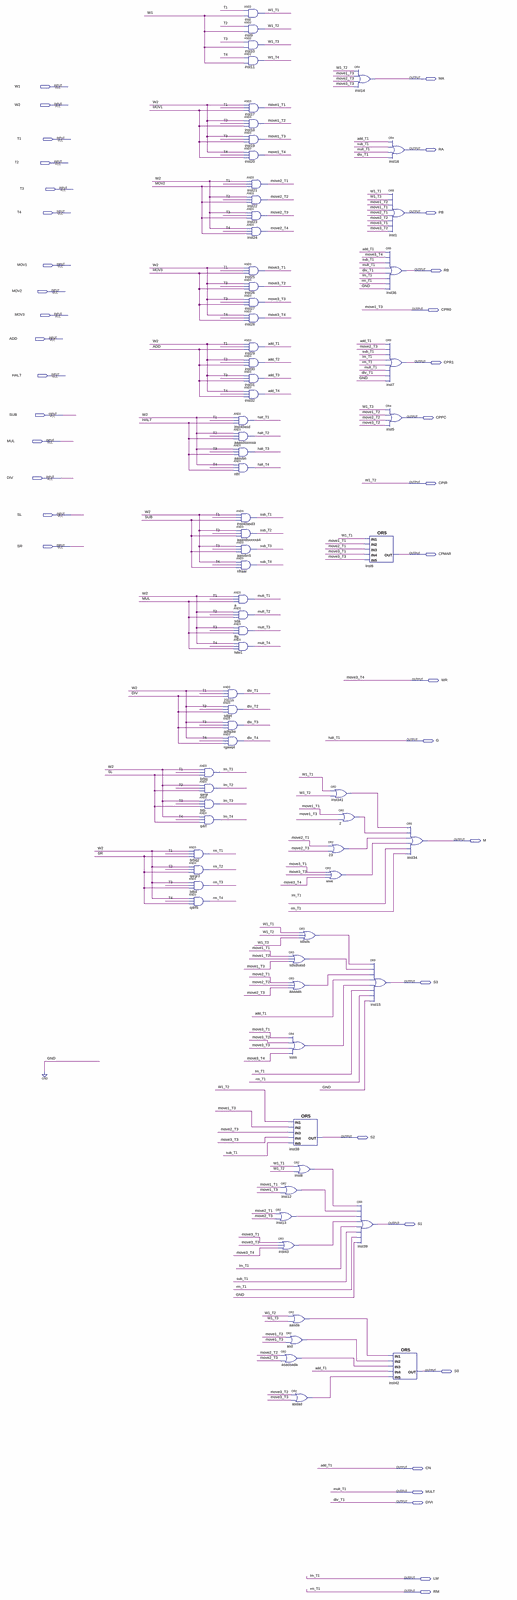
[diagram p0: schematic sheet, whole]
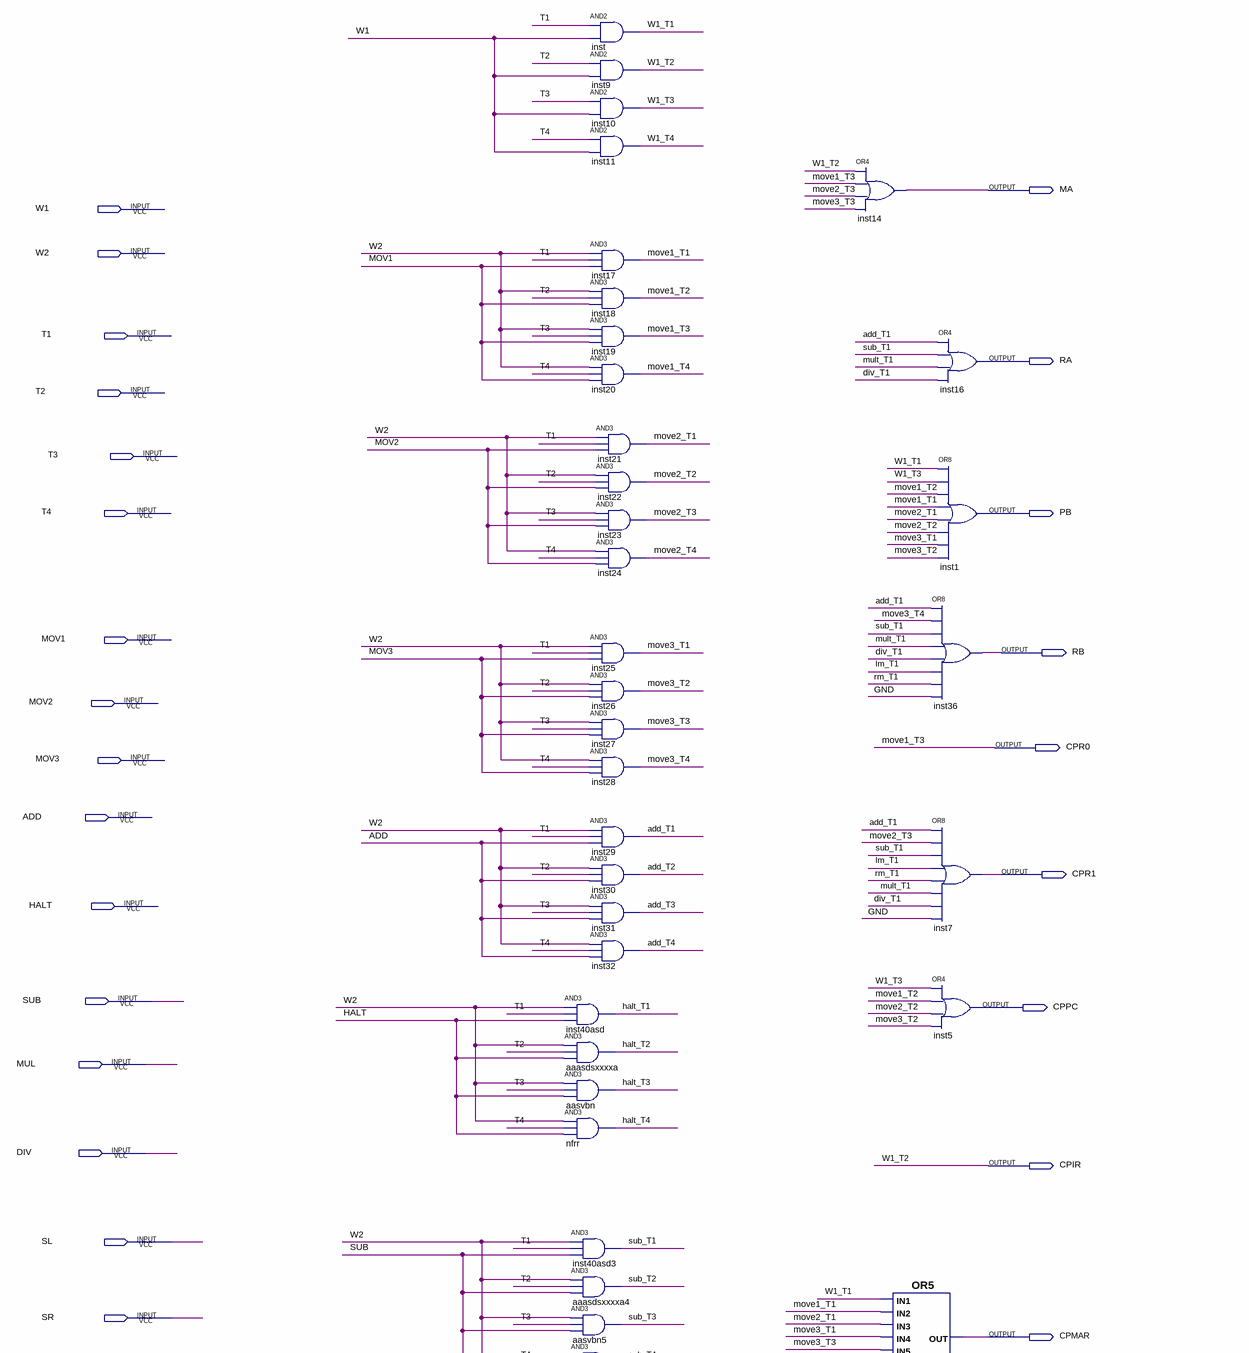
[diagram p1: schematic sheet, upper part]
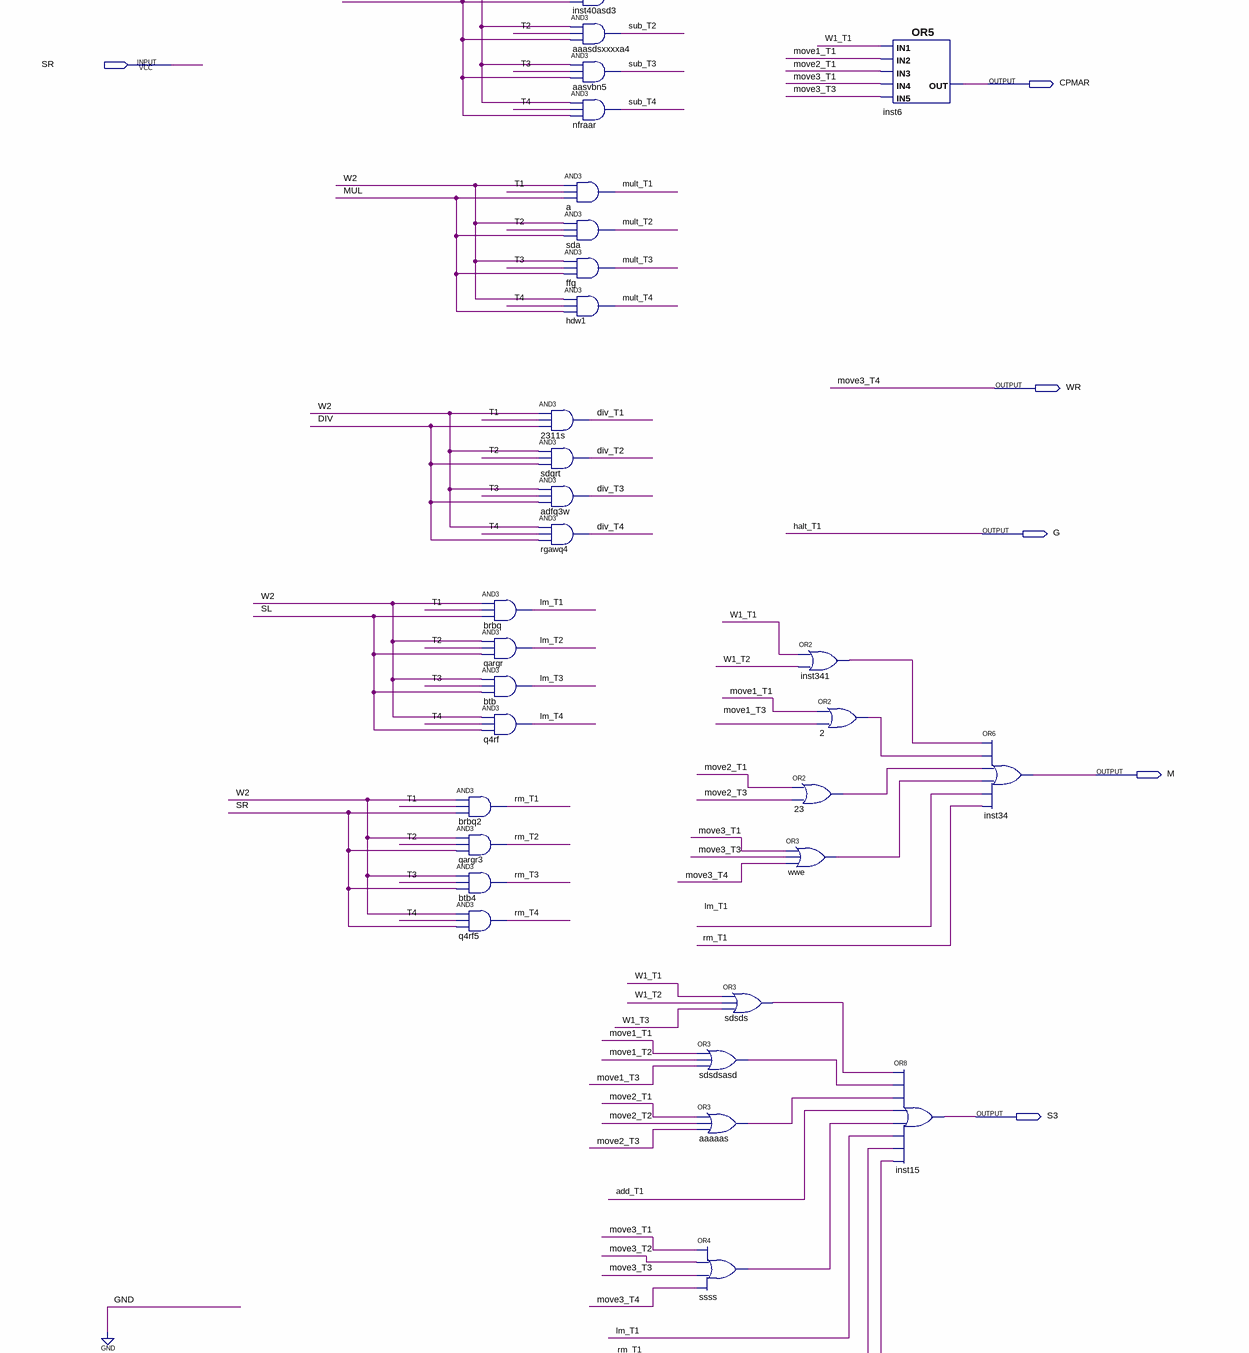
[diagram p2: schematic sheet, middle part]
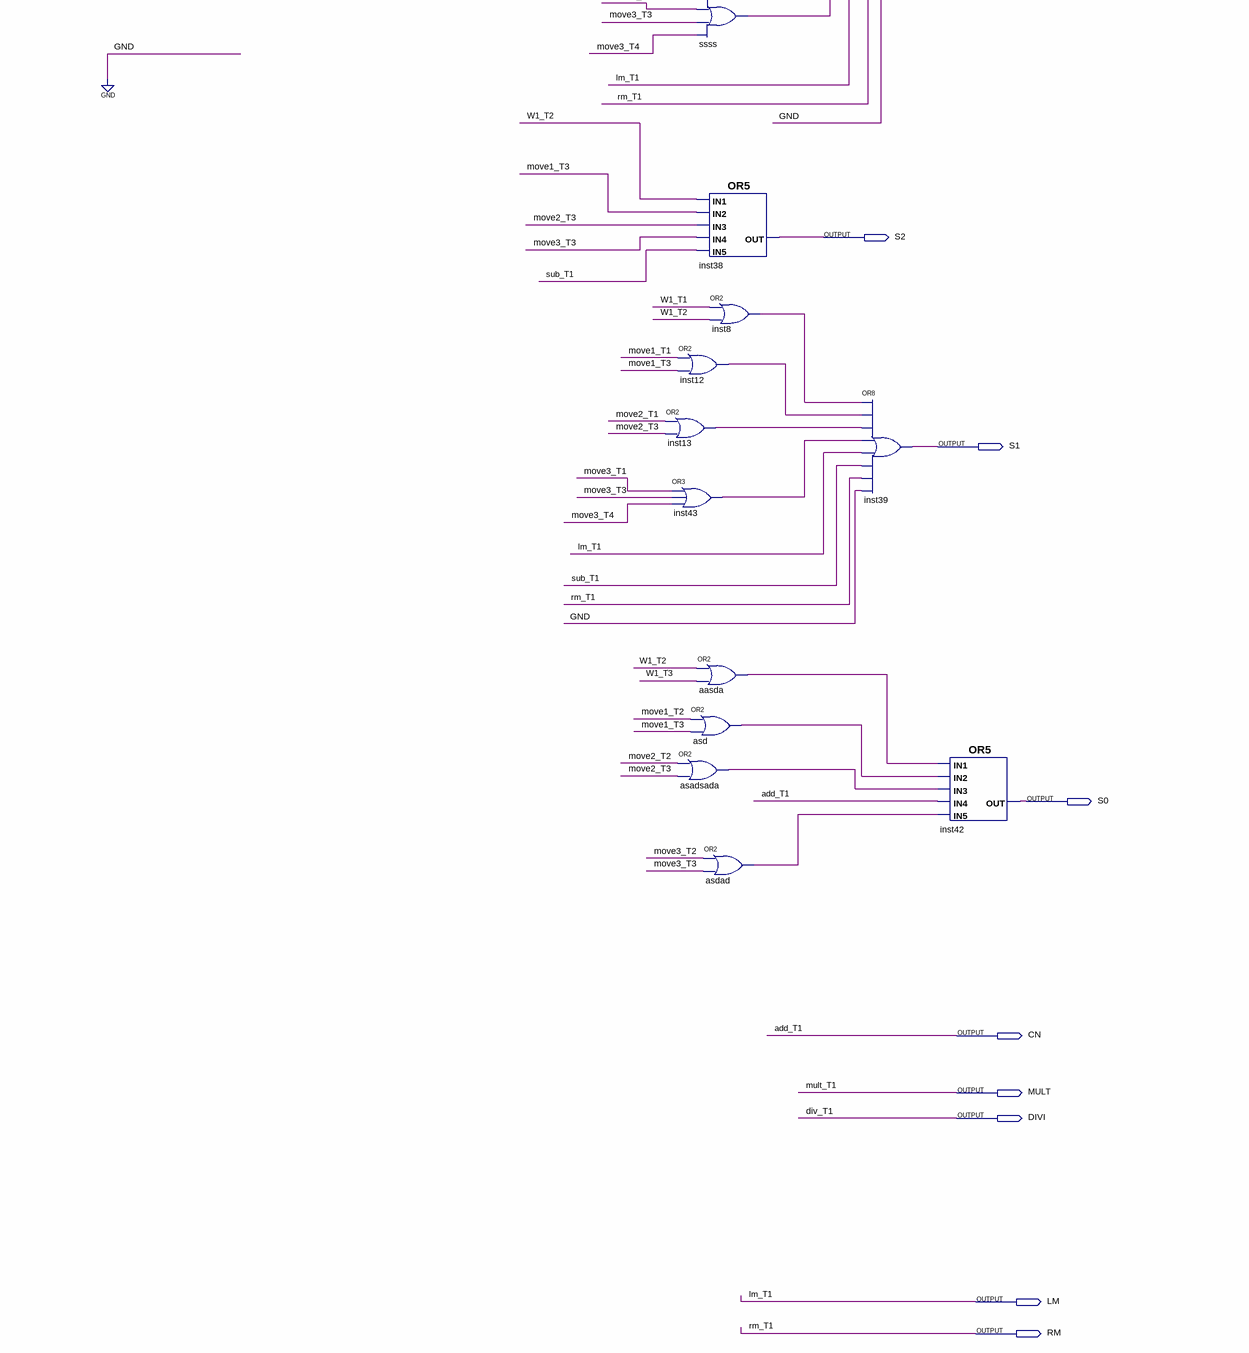
[diagram p3: schematic sheet, lower part]
// Quartus schematic OP_CONTROL.bdf as structural Verilog: 72 symbols, 37 pins
module OP_CONTROL (
  input  W1,
  input  W2,
  input  T1,
  input  T2,
  input  T3,
  input  T4,
  input  MOV1,
  input  MOV2,
  input  MOV3,
  input  ADD,
  input  HALT,
  input  SUB,
  input  MUL,
  input  DIV,
  input  SL,
  input  SR,
  output MA,
  output RA,
  output PB,
  output RB,
  output CPR0,
  output CPR1,
  output CPPC,
  output CPIR,
  output CPMAR,
  output WR,
  output G,
  output M,
  output S3,
  output S2,
  output S1,
  output S0,
  output CN,
  output MULT,
  output DIVI,
  output LM,
  output RM
);

  wire aaaaas_out, aasda_out, add_T2, add_T3, add_T4, asadsada_out, asd_out, asdad_out, div_T2, div_T3,
       div_T4, halt_T2, halt_T3, halt_T4, inst8_out, inst12_out, inst13_out, inst43_out, inst341_out, lm_T2,
       lm_T3, lm_T4, move1_T1, move1_T2, move1_T4, move2_T1, move2_T2, move2_T3, move2_T4, move3_T1,
       move3_T2, move3_T3, mult_T2, mult_T3, mult_T4, n2_out, n23_out, rm_T2, rm_T3, rm_T4, sdsds_out,
       sdsdsasd_out, ssss_out, sub_T1, sub_T2, sub_T3, sub_T4, W1_T1, W1_T3, W1_T4, wwe_out;

  and brbq2 (RM, W2, T1, SR);
  and qargr3 (rm_T2, W2, T2, SR);
  and btb4 (rm_T3, W2, T3, SR);
  and q4rf5 (rm_T4, W2, T4, SR);
  and brbq (LM, W2, T1, SL);
  and qargr (lm_T2, W2, T2, SL);
  and btb (lm_T3, W2, T3, SL);
  and q4rf (lm_T4, W2, T4, SL);
  and inst40asd (G, W2, T1, HALT);
  and aaasdsxxxxa (halt_T2, W2, T2, HALT);
  and aasvbn (halt_T3, W2, T3, HALT);
  and nfrr (halt_T4, W2, T4, HALT);
  and a (MULT, W2, T1, MUL);
  and sda (mult_T2, W2, T2, MUL);
  and ffg (mult_T3, W2, T3, MUL);
  and hdw1 (mult_T4, W2, T4, MUL);
  and u_2311s (DIVI, W2, T1, DIV);
  and sdqrt (div_T2, W2, T2, DIV);
  and adfq3w (div_T3, W2, T3, DIV);
  and rgawq4 (div_T4, W2, T4, DIV);
  and inst (W1_T1, T1, W1);
  and inst9 (CPIR, T2, W1);
  and inst10 (W1_T3, T3, W1);
  and inst11 (W1_T4, T4, W1);
  and inst17 (move1_T1, W2, T1, MOV1);
  and inst18 (move1_T2, W2, T2, MOV1);
  and inst19 (CPR0, W2, T3, MOV1);
  and inst20 (move1_T4, W2, T4, MOV1);
  and inst21 (move2_T1, W2, T1, MOV2);
  and inst22 (move2_T2, W2, T2, MOV2);
  and inst23 (move2_T3, W2, T3, MOV2);
  and inst24 (move2_T4, W2, T4, MOV2);
  and inst25 (move3_T1, W2, T1, MOV3);
  and inst26 (move3_T2, W2, T2, MOV3);
  and inst27 (move3_T3, W2, T3, MOV3);
  and inst28 (WR, W2, T4, MOV3);
  and inst29 (CN, W2, T1, ADD);
  and inst30 (add_T2, W2, T2, ADD);
  and inst31 (add_T3, W2, T3, ADD);
  and inst32 (add_T4, W2, T4, ADD);
  and inst40asd3 (sub_T1, W2, T1, SUB);
  and aaasdsxxxxa4 (sub_T2, W2, T2, SUB);
  and aasvbn5 (sub_T3, W2, T3, SUB);
  and nfraar (sub_T4, W2, T4, SUB);
  or inst13 (inst13_out, move2_T1, move2_T3);
  or sdsdsasd (sdsdsasd_out, move1_T1, move1_T2, CPR0);
  or aaaaas (aaaaas_out, move2_T1, move2_T2, move2_T3);
  or ssss (ssss_out, move3_T1, move3_T2, move3_T3, WR);
  or inst38 (S2, CPIR, CPR0, move2_T3, move3_T3, sub_T1);
  or inst8 (inst8_out, W1_T1, CPIR);
  or inst12 (inst12_out, move1_T1, CPR0);
  or inst43 (inst43_out, move3_T1, move3_T3, WR);
  or aasda (aasda_out, CPIR, W1_T3);
  or asd (asd_out, move1_T2, CPR0);
  or asadsada (asadsada_out, move2_T2, move2_T3);
  or asdad (asdad_out, move3_T2, move3_T3);
  or sdsds (sdsds_out, W1_T1, CPIR, W1_T3);
  or inst341 (inst341_out, W1_T1, CPIR);
  or u_2 (n2_out, move1_T1, CPR0);
  or u_23 (n23_out, move2_T1, move2_T3);
  or wwe (wwe_out, move3_T1, move3_T3, WR);
  or inst14 (MA, CPIR, CPR0, move2_T3, move3_T3);
  or inst39 (S1, inst8_out, inst12_out, inst13_out, inst43_out, LM, sub_T1, RM, 1'b0);
  or inst6 (CPMAR, W1_T1, move1_T1, move2_T1, move3_T1, move3_T3);
  or inst15 (S3, sdsds_out, sdsdsasd_out, aaaaas_out, CN, ssss_out, LM, RM, 1'b0);
  or inst16 (RA, CN, sub_T1, MULT, DIVI);
  or inst1 (PB, W1_T1, W1_T3, move1_T2, move1_T1, move2_T1, move2_T2, move3_T1, move3_T2);
  or inst36 (RB, CN, WR, sub_T1, MULT, DIVI, LM, RM, 1'b0);
  or inst7 (CPR1, CN, move2_T3, sub_T1, LM, RM, MULT, DIVI, 1'b0);
  or inst5 (CPPC, W1_T3, move1_T2, move2_T2, move3_T2);
  or inst42 (S0, aasda_out, asd_out, asadsada_out, CN, asdad_out);
  or inst34 (M, inst341_out, n2_out, n23_out, wwe_out, LM, RM);

  // Other names for the same wires on the sheet: add_T1 = CN; div_T1 = DIVI; halt_T1 = G; lm_T1 = LM; move1_T3 = CPR0;
  //   move3_T4 = WR; mult_T1 = MULT; rm_T1 = RM; W1_T2 = CPIR
endmodule
